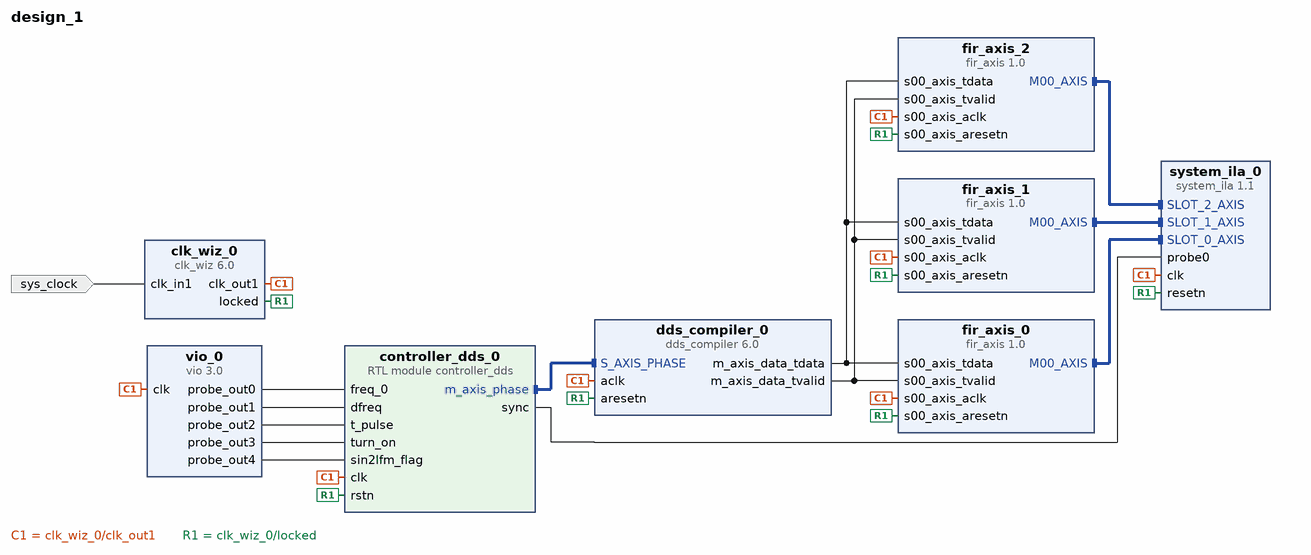
[diagram p0: block diagram of the top level]
# Vivado block design design_1, xc7z020clg400-1, Vivado 2019.1.2
create_bd_design design_1

create_bd_port -dir I -type clk sys_clock
set_property -dict {CONFIG.FREQ_HZ 125000000 CONFIG.PHASE 0.000} [get_bd_ports sys_clock]

create_bd_cell -type ip -vlnv xilinx.com:ip:dds_compiler:6.0 dds_compiler_0
set_property -dict [list \
  CONFIG.DATA_Has_TLAST Not_Required \
  CONFIG.Has_ARESETn true \
  CONFIG.Has_Phase_Out false \
  CONFIG.M_DATA_Has_TUSER Not_Required \
  CONFIG.Noise_Shaping None \
  CONFIG.Output_Frequency1 0 \
  CONFIG.Output_Selection Cosine \
  CONFIG.Output_Width 8 \
  CONFIG.PINC1 0 \
  CONFIG.Parameter_Entry Hardware_Parameters \
  CONFIG.Phase_Increment Streaming \
  CONFIG.Phase_Width 16 \
  CONFIG.S_PHASE_Has_TUSER Not_Required \
] [get_bd_cells dds_compiler_0]
create_bd_cell -type ip -vlnv xilinx.com:ip:clk_wiz:6.0 clk_wiz_0
set_property -dict [list \
  CONFIG.CLK_IN1_BOARD_INTERFACE sys_clock \
  CONFIG.USE_BOARD_FLOW true \
  CONFIG.USE_RESET false \
] [get_bd_cells clk_wiz_0]
create_bd_cell -type module -reference controller_dds controller_dds_0
create_bd_cell -type ip -vlnv xilinx.com:ip:vio:3.0 vio_0
set_property -dict [list \
  CONFIG.C_NUM_PROBE_IN 0 \
  CONFIG.C_NUM_PROBE_OUT 5 \
  CONFIG.C_PROBE_OUT0_WIDTH 32 \
  CONFIG.C_PROBE_OUT1_INIT_VAL 0x00000131 \
  CONFIG.C_PROBE_OUT1_WIDTH 32 \
  CONFIG.C_PROBE_OUT2_INIT_VAL 0x00010000 \
  CONFIG.C_PROBE_OUT2_WIDTH 32 \
  CONFIG.C_PROBE_OUT3_INIT_VAL 0x1 \
  CONFIG.C_PROBE_OUT4_INIT_VAL 0x1 \
] [get_bd_cells vio_0]
create_bd_cell -type ip -vlnv xilinx.com:ip:system_ila:1.1 system_ila_0
set_property -dict [list \
  CONFIG.C_DATA_DEPTH 4096 \
  CONFIG.C_MON_TYPE MIX \
  CONFIG.C_NUM_MONITOR_SLOTS 3 \
  CONFIG.C_SLOT 2 \
  CONFIG.C_SLOT_0_INTF_TYPE xilinx.com:interface:axis_rtl:1.0 \
  CONFIG.C_SLOT_1_INTF_TYPE xilinx.com:interface:axis_rtl:1.0 \
  CONFIG.C_SLOT_2_INTF_TYPE xilinx.com:interface:axis_rtl:1.0 \
] [get_bd_cells system_ila_0]
create_bd_cell -type ip -vlnv xilinx.com:rostov_ip:fir_axis:1.0 fir_axis_0
set_property -dict [list \
  CONFIG.MEM_FILE d:/work/radar_course/lesson_3/vivado/arty_z7_simfir/arty_z7_simfir.srcs/sources_1/imports/hdl/coef_lp.mem \
] [get_bd_cells fir_axis_0]
create_bd_cell -type ip -vlnv xilinx.com:rostov_ip:fir_axis:1.0 fir_axis_1
set_property -dict [list \
  CONFIG.MEM_FILE d:/work/radar_course/lesson_3/vivado/arty_z7_simfir/arty_z7_simfir.srcs/sources_1/imports/hdl/coef_bp.mem \
] [get_bd_cells fir_axis_1]
create_bd_cell -type ip -vlnv xilinx.com:rostov_ip:fir_axis:1.0 fir_axis_2
set_property -dict [list \
  CONFIG.MEM_FILE d:/work/radar_course/lesson_3/vivado/arty_z7_simfir/arty_z7_simfir.srcs/sources_1/imports/hdl/coef_hp.mem \
] [get_bd_cells fir_axis_2]

# ---- connections ----

connect_bd_intf_net [get_bd_intf_pins fir_axis_2/M00_AXIS] [get_bd_intf_pins system_ila_0/SLOT_2_AXIS]
connect_bd_intf_net [get_bd_intf_pins dds_compiler_0/S_AXIS_PHASE] [get_bd_intf_pins controller_dds_0/m_axis_phase]
connect_bd_intf_net [get_bd_intf_pins fir_axis_1/M00_AXIS] [get_bd_intf_pins system_ila_0/SLOT_1_AXIS]
connect_bd_intf_net [get_bd_intf_pins fir_axis_0/M00_AXIS] [get_bd_intf_pins system_ila_0/SLOT_0_AXIS]
connect_bd_net [get_bd_ports sys_clock] [get_bd_pins clk_wiz_0/clk_in1]
connect_bd_net [get_bd_pins clk_wiz_0/clk_out1] \
  [get_bd_pins vio_0/clk] [get_bd_pins controller_dds_0/clk] [get_bd_pins dds_compiler_0/aclk] [get_bd_pins system_ila_0/clk] \
  [get_bd_pins fir_axis_0/s00_axis_aclk] [get_bd_pins fir_axis_1/s00_axis_aclk] [get_bd_pins fir_axis_2/s00_axis_aclk]
connect_bd_net [get_bd_pins vio_0/probe_out0] [get_bd_pins controller_dds_0/freq_0]
connect_bd_net [get_bd_pins vio_0/probe_out1] [get_bd_pins controller_dds_0/dfreq]
connect_bd_net [get_bd_pins vio_0/probe_out2] [get_bd_pins controller_dds_0/t_pulse]
connect_bd_net [get_bd_pins vio_0/probe_out3] [get_bd_pins controller_dds_0/turn_on]
connect_bd_net [get_bd_pins vio_0/probe_out4] [get_bd_pins controller_dds_0/sin2lfm_flag]
connect_bd_net [get_bd_pins clk_wiz_0/locked] \
  [get_bd_pins controller_dds_0/rstn] [get_bd_pins dds_compiler_0/aresetn] [get_bd_pins system_ila_0/resetn] \
  [get_bd_pins fir_axis_0/s00_axis_aresetn] [get_bd_pins fir_axis_1/s00_axis_aresetn] \
  [get_bd_pins fir_axis_2/s00_axis_aresetn]
connect_bd_net [get_bd_pins dds_compiler_0/m_axis_data_tdata] \
  [get_bd_pins fir_axis_0/s00_axis_tdata] [get_bd_pins fir_axis_1/s00_axis_tdata] [get_bd_pins fir_axis_2/s00_axis_tdata]
connect_bd_net [get_bd_pins dds_compiler_0/m_axis_data_tvalid] \
  [get_bd_pins fir_axis_0/s00_axis_tvalid] [get_bd_pins fir_axis_1/s00_axis_tvalid] [get_bd_pins fir_axis_2/s00_axis_tvalid]
connect_bd_net [get_bd_pins controller_dds_0/sync] [get_bd_pins system_ila_0/probe0]

validate_bd_design
save_bd_design
